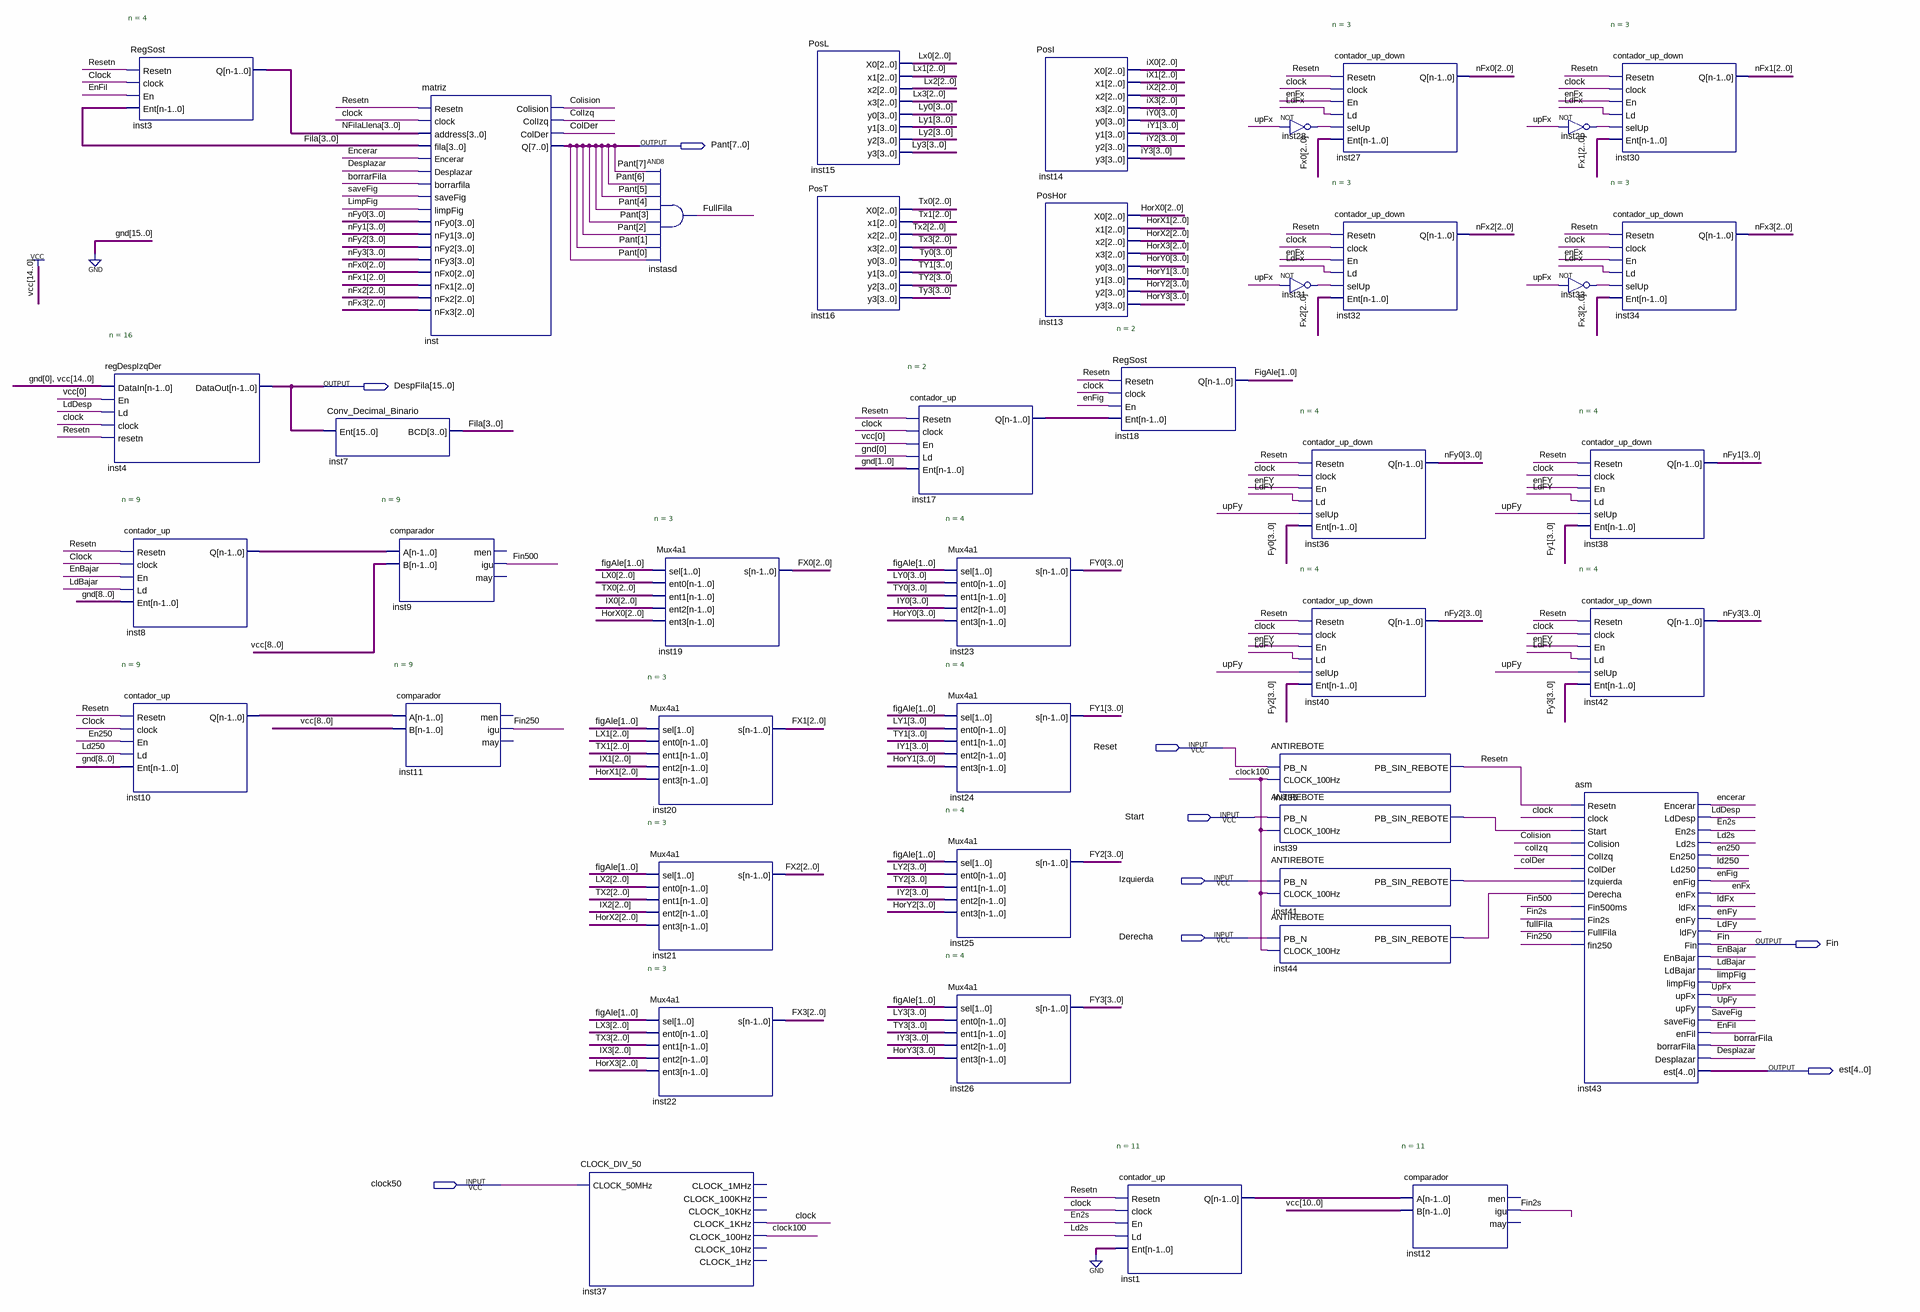
[diagram p0: schematic sheet]
// Quartus schematic Tetris.bdf as structural Verilog: 43 symbols, 9 pins
module Tetris (
  input  Reset,
  input  Start,
  input  Izquierda,
  input  Derecha,
  input  clock50,
  output [7:0] Pant,
  output [15:0] DespFila,
  output Fin,
  output [4:0] est
);

  wire borrarFila, clock, clock100, ColDer, Colision, ColIzq, Desplazar, En2s, En250, EnBajar, Encerar,
       enFig, EnFil, enFx, enFY, Fin2s, Fin250, Fin500, FullFila, inst28_out, inst29_out, inst31_out,
       inst33_out, inst39_pb_sin_rebote, inst41_pb_sin_rebote, inst44_pb_sin_rebote, Ld2s, Ld250, LdBajar,
       LdDesp, LdFx, LdFY, LimpFig, Resetn, saveFig, upFx, upFy;
  wire [1:0] FigAle, inst17_q;
  wire [2:0] FX0, FX1, FX2, FX3, HorX0, HorX1, HorX2, HorX3, iX0, iX1, IX2, iX3, Lx0, Lx1, Lx2, Lx3, nFx0,
       nFx1, nFx2, nFx3, Tx0, TX1, Tx2, Tx3;
  wire [3:0] Fila, Fy0, Fy1, Fy2, Fy3, HorY0, HorY1, HorY2, HorY3, iY0, iY1, iY2, iY3, Ly0, Ly1, Ly2, Ly3,
       NFilaLlena, nFy0, nFy1, nFy2, nFy3, Ty0, TY1, TY2, Ty3;
  wire [8:0] inst8_q, inst10_q;
  wire [10:0] inst1_q;

  RegSost #(.n(4)) inst3 (.Resetn(Resetn), .clock(clock), .En(EnFil), .Ent(Fila), .Q(NFilaLlena));
  regDespIzqDer #(.n(16)) inst4 (
    .DataIn(16'b0111111111111111), .En(1'b1), .Ld(LdDesp), .clock(clock), .resetn(Resetn), .DataOut(DespFila));
  contador_up #(.n(9)) inst8 (.Resetn(Resetn), .clock(clock), .En(EnBajar), .Ld(LdBajar), .Ent({9{1'b0}}), .Q(inst8_q));
  contador_up #(.n(9)) inst10 (.Resetn(Resetn), .clock(clock), .En(En250), .Ld(Ld250), .Ent({9{1'b0}}), .Q(inst10_q));
  Conv_Decimal_Binario inst7 (.Ent(DespFila), .BCD(Fila));
  matriz inst (
    .Resetn(Resetn), .clock(clock), .address(NFilaLlena), .fila(Fila), .Encerar(Encerar),
    .Desplazar(Desplazar), .borrarfila(borrarFila), .saveFig(saveFig), .limpFig(LimpFig), .nFy0(nFy0),
    .nFy1(nFy1), .nFy2(nFy2), .nFy3(nFy3), .nFx0(nFx0), .nFx1(nFx1), .nFx2(nFx2), .nFx3(nFx3),
    .Colision(Colision), .ColIzq(ColIzq), .ColDer(ColDer), .Q(Pant));
  comparador #(.n(9)) inst9 (.A(inst8_q), .B({9{1'b1}}), .igu(Fin500));  // open: men, may
  comparador #(.n(9)) inst11 (.A(inst10_q), .B({9{1'b1}}), .igu(Fin250));  // open: men, may
  CLOCK_DIV_50 inst37 (
    .CLOCK_50MHz(clock50), .CLOCK_1KHz(clock), .CLOCK_100Hz(clock100));  // open: CLOCK_1MHz, CLOCK_100KHz, CLOCK_10KHz, CLOCK_10Hz, CLOCK_1Hz
  and instasd (FullFila, Pant[7], Pant[6], Pant[5], Pant[4], Pant[3], Pant[2], Pant[1], Pant[0]);
  Mux4a1 #(.n(3)) inst19 (.sel(FigAle), .ent0(Lx0), .ent1(Tx0), .ent2(iX0), .ent3(HorX0), .s(FX0));
  Mux4a1 #(.n(3)) inst20 (.sel(FigAle), .ent0(Lx1), .ent1(TX1), .ent2(iX1), .ent3(HorX1), .s(FX1));
  Mux4a1 #(.n(3)) inst21 (.sel(FigAle), .ent0(Lx2), .ent1(Tx2), .ent2(IX2), .ent3(HorX2), .s(FX2));
  Mux4a1 #(.n(3)) inst22 (.sel(FigAle), .ent0(Lx3), .ent1(Tx3), .ent2(iX3), .ent3(HorX3), .s(FX3));
  PosL inst15 (.X0(Lx0), .x1(Lx1), .x2(Lx2), .x3(Lx3), .y0(Ly0), .y1(Ly1), .y2(Ly2), .y3(Ly3));
  PosT inst16 (.X0(Tx0), .x1(TX1), .x2(Tx2), .x3(Tx3), .y0(Ty0), .y1(TY1), .y2(TY2), .y3(Ty3));
  contador_up #(.n(2)) inst17 (.Resetn(Resetn), .clock(clock), .En(1'b1), .Ld(1'b0), .Ent(2'b00), .Q(inst17_q));
  Mux4a1 #(.n(4)) inst23 (.sel(FigAle), .ent0(Ly0), .ent1(Ty0), .ent2(iY0), .ent3(HorY0), .s(Fy0));
  Mux4a1 #(.n(4)) inst24 (.sel(FigAle), .ent0(Ly1), .ent1(TY1), .ent2(iY1), .ent3(HorY1), .s(Fy1));
  Mux4a1 #(.n(4)) inst25 (.sel(FigAle), .ent0(Ly2), .ent1(TY2), .ent2(iY2), .ent3(HorY2), .s(Fy2));
  Mux4a1 #(.n(4)) inst26 (.sel(FigAle), .ent0(Ly3), .ent1(Ty3), .ent2(iY3), .ent3(HorY3), .s(Fy3));
  PosI inst14 (.X0(iX0), .x1(iX1), .x2(IX2), .x3(iX3), .y0(iY0), .y1(iY1), .y2(iY2), .y3(iY3));
  PosHor inst13 (.X0(HorX0), .x1(HorX1), .x2(HorX2), .x3(HorX3), .y0(HorY0), .y1(HorY1), .y2(HorY2), .y3(HorY3));
  RegSost #(.n(2)) inst18 (.Resetn(Resetn), .clock(clock), .En(enFig), .Ent(inst17_q), .Q(FigAle));
  contador_up #(.n(11)) inst1 (.Resetn(Resetn), .clock(clock), .En(En2s), .Ld(Ld2s), .Ent({11{1'b0}}), .Q(inst1_q));
  not inst28 (inst28_out, upFx);
  not inst31 (inst31_out, upFx);
  ANTIREBOTE inst35 (.PB_N(Reset), .CLOCK_100Hz(clock100), .PB_SIN_REBOTE(Resetn));
  ANTIREBOTE inst39 (.PB_N(Start), .CLOCK_100Hz(clock100), .PB_SIN_REBOTE(inst39_pb_sin_rebote));
  ANTIREBOTE inst41 (.PB_N(Izquierda), .CLOCK_100Hz(clock100), .PB_SIN_REBOTE(inst41_pb_sin_rebote));
  ANTIREBOTE inst44 (.PB_N(Derecha), .CLOCK_100Hz(clock100), .PB_SIN_REBOTE(inst44_pb_sin_rebote));
  contador_up_down #(.n(3)) inst27 (
    .Resetn(Resetn), .clock(clock), .En(enFx), .Ld(LdFx), .selUp(inst28_out), .Ent(FX0), .Q(nFx0));
  contador_up_down #(.n(3)) inst32 (
    .Resetn(Resetn), .clock(clock), .En(enFx), .Ld(LdFx), .selUp(inst31_out), .Ent(FX2), .Q(nFx2));
  contador_up_down #(.n(4)) inst36 (
    .Resetn(Resetn), .clock(clock), .En(enFY), .Ld(LdFY), .selUp(upFy), .Ent(Fy0), .Q(nFy0));
  contador_up_down #(.n(4)) inst40 (
    .Resetn(Resetn), .clock(clock), .En(enFY), .Ld(LdFY), .selUp(upFy), .Ent(Fy2), .Q(nFy2));
  comparador #(.n(11)) inst12 (.A(inst1_q), .B({11{1'b1}}), .igu(Fin2s));  // open: men, may
  not inst29 (inst29_out, upFx);
  not inst33 (inst33_out, upFx);
  contador_up_down #(.n(4)) inst38 (
    .Resetn(Resetn), .clock(clock), .En(enFY), .Ld(LdFY), .selUp(upFy), .Ent(Fy1), .Q(nFy1));
  contador_up_down #(.n(4)) inst42 (
    .Resetn(Resetn), .clock(clock), .En(enFY), .Ld(LdFY), .selUp(upFy), .Ent(Fy3), .Q(nFy3));
  asm inst43 (
    .Resetn(Resetn), .clock(clock), .Start(inst39_pb_sin_rebote), .Colision(Colision), .ColIzq(ColIzq),
    .ColDer(ColDer), .Izquierda(inst41_pb_sin_rebote), .Derecha(inst44_pb_sin_rebote), .Fin500ms(Fin500),
    .Fin2s(Fin2s), .FullFila(FullFila), .fin250(Fin250), .Encerar(Encerar), .LdDesp(LdDesp), .En2s(En2s),
    .Ld2s(Ld2s), .En250(En250), .Ld250(Ld250), .enFig(enFig), .enFx(enFx), .ldFx(LdFx), .enFy(enFY),
    .ldFy(LdFY), .Fin(Fin), .EnBajar(EnBajar), .LdBajar(LdBajar), .limpFig(LimpFig), .upFx(upFx),
    .upFy(upFy), .saveFig(saveFig), .enFil(EnFil), .borrarFila(borrarFila), .Desplazar(Desplazar), .est(est));
  contador_up_down #(.n(3)) inst30 (
    .Resetn(Resetn), .clock(clock), .En(enFx), .Ld(LdFx), .selUp(inst29_out), .Ent(FX1), .Q(nFx1));
  contador_up_down #(.n(3)) inst34 (
    .Resetn(Resetn), .clock(clock), .En(enFx), .Ld(LdFx), .selUp(inst33_out), .Ent(FX3), .Q(nFx3));
endmodule
